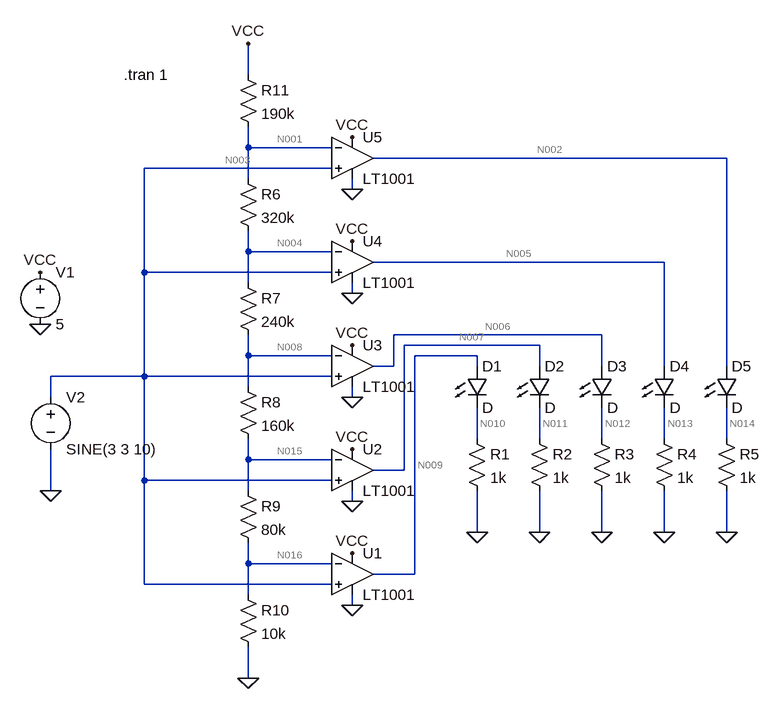
[diagram p0: schematic ComparotorLEDVolumeLadder.asc]
ComparotorLEDVolumeLadder.asc, the LTspice schematic file:
Version 4
SHEET 1 928 680
WIRE 112 -448 112 -496
WIRE 112 -336 112 -368
WIRE 240 -336 112 -336
WIRE 848 -320 304 -320
WIRE 240 -304 -48 -304
WIRE 112 -288 112 -336
WIRE 272 -272 272 -288
WIRE 112 -176 112 -208
WIRE 240 -176 112 -176
WIRE 752 -160 304 -160
WIRE -48 -144 -48 -304
WIRE 240 -144 -48 -144
WIRE 112 -128 112 -176
WIRE 272 -112 272 -128
WIRE 656 -48 336 -48
WIRE 560 -32 352 -32
WIRE 112 -16 112 -48
WIRE 240 -16 112 -16
WIRE 464 -16 368 -16
WIRE 336 0 336 -48
WIRE 336 0 304 0
WIRE 464 0 464 -16
WIRE 560 0 560 -32
WIRE 656 0 656 -48
WIRE 752 0 752 -160
WIRE 848 0 848 -320
WIRE -48 16 -48 -144
WIRE -48 16 -192 16
WIRE 240 16 -48 16
WIRE 112 32 112 -16
WIRE -192 48 -192 16
WIRE 272 48 272 32
WIRE 464 112 464 64
WIRE 560 112 560 64
WIRE 656 112 656 64
WIRE 752 112 752 64
WIRE 848 112 848 64
WIRE 112 144 112 112
WIRE 240 144 112 144
WIRE 352 160 352 -32
WIRE 352 160 304 160
WIRE -48 176 -48 16
WIRE 240 176 -48 176
WIRE -192 192 -192 128
WIRE 112 192 112 144
WIRE 272 208 272 192
WIRE 464 256 464 192
WIRE 560 256 560 192
WIRE 656 256 656 192
WIRE 752 256 752 192
WIRE 848 256 848 192
WIRE 112 304 112 272
WIRE 240 304 112 304
WIRE 368 320 368 -16
WIRE 368 320 304 320
WIRE -48 336 -48 176
WIRE 240 336 -48 336
WIRE 112 352 112 304
WIRE 272 368 272 352
WIRE 112 480 112 432
FLAG 272 368 0
FLAG 272 208 0
FLAG 272 -112 0
FLAG 272 48 0
FLAG 272 -272 0
FLAG 464 256 0
FLAG 560 256 0
FLAG 656 256 0
FLAG 752 256 0
FLAG 848 256 0
FLAG 272 288 VCC
FLAG 272 128 VCC
FLAG 272 -32 VCC
FLAG 272 -352 VCC
FLAG 112 480 0
FLAG -208 -64 0
FLAG -208 -144 VCC
FLAG -192 192 0
FLAG 112 -496 VCC
FLAG 272 -192 VCC
SYMBOL LED 544 0 R0
SYMATTR InstName D2
SYMBOL LED 640 0 R0
SYMATTR InstName D3
SYMBOL LED 736 0 R0
SYMATTR InstName D4
SYMBOL LED 832 0 R0
SYMATTR InstName D5
SYMBOL res 448 96 R0
SYMATTR InstName R1
SYMATTR Value 1k
SYMBOL res 544 96 R0
SYMATTR InstName R2
SYMATTR Value 1k
SYMBOL res 640 96 R0
SYMATTR InstName R3
SYMATTR Value 1k
SYMBOL res 736 96 R0
SYMATTR InstName R4
SYMATTR Value 1k
SYMBOL res 832 96 R0
SYMATTR InstName R5
SYMATTR Value 1k
SYMBOL res 96 -304 R0
SYMATTR InstName R6
SYMATTR Value 320k
SYMBOL res 96 -144 R0
SYMATTR InstName R7
SYMATTR Value 240k
SYMBOL res 96 16 R0
SYMATTR InstName R8
SYMATTR Value 160k
SYMBOL res 96 176 R0
SYMATTR InstName R9
SYMATTR Value 80k
SYMBOL res 96 336 R0
SYMATTR InstName R10
SYMATTR Value 10k
SYMBOL voltage -208 -160 R0
WINDOW 123 0 0 Left 0
WINDOW 39 0 0 Left 0
SYMATTR InstName V1
SYMATTR Value 5
SYMBOL voltage -192 32 R0
WINDOW 123 0 0 Left 0
WINDOW 39 0 0 Left 0
SYMATTR InstName V2
SYMATTR Value SINE(3 3 10)
SYMBOL res 96 -464 R0
SYMATTR InstName R11
SYMATTR Value 190k
SYMBOL OpAmps\\LT1001 272 -384 R0
SYMATTR InstName U5
SYMBOL OpAmps\\LT1001 272 256 R0
SYMATTR InstName U1
SYMBOL OpAmps\\LT1001 272 96 R0
SYMATTR InstName U2
SYMBOL OpAmps\\LT1001 272 -64 R0
SYMATTR InstName U3
SYMBOL OpAmps\\LT1001 272 -224 R0
SYMATTR InstName U4
SYMBOL LED 448 0 R0
SYMATTR InstName D1
TEXT -80 -448 Left 2 !.tran 1

The netlist it stands for:
* ComparotorLEDVolumeLadder.asc
D2 N007 N011 D
D3 N006 N012 D
D4 N005 N013 D
D5 N002 N014 D
R1 N010 0 1k
R2 N011 0 1k
R3 N012 0 1k
R4 N013 0 1k
R5 N014 0 1k
R6 N001 N004 320k
R7 N004 N008 240k
R8 N008 N015 160k
R9 N015 N016 80k
R10 N016 0 10k
V1 VCC 0 5
V2 N003 0 SINE(3 3 10)
R11 VCC N001 190k
XU5 N003 N001 VCC 0 N002 LT1001  ; pins In+ In- V+ V- OUT
XU1 N003 N016 VCC 0 N009 LT1001  ; pins In+ In- V+ V- OUT
XU2 N003 N015 VCC 0 N007 LT1001  ; pins In+ In- V+ V- OUT
XU3 N003 N008 VCC 0 N006 LT1001  ; pins In+ In- V+ V- OUT
XU4 N003 N004 VCC 0 N005 LT1001  ; pins In+ In- V+ V- OUT
D1 N009 N010 D
.model D D
.lib standard.dio
.tran 1
.lib LTC.lib
.backanno
.end

* Results of the author's LTspice run, read from the files saved beside the schematic
* Operating Point, zero values left out:
*   V(n007) = 3.954 V
*   V(n011) = 3.268 V
*   V(n006) = 3.954 V
*   V(n012) = 3.268 V
*   V(n005) = 919.2 mV
*   V(n013) = 295.6 mV
*   V(n002) = 919.1 mV
*   V(n014) = 295.5 mV
*   V(n010) = 3.268 V
*   V(n001) = 4.066 V
*   V(n004) = 3.111 V
*   V(n008) = 2.396 V
*   V(n015) = 1.917 V
*   V(n016) = 1.437 V
*   V(vcc) = 5 V
*   V(n003) = 3 V
*   V(n009) = 3.954 V
*   I(D1) = 3.268 mA
*   I(D5) = 295.5 µA
*   I(D4) = 295.6 µA
*   I(D3) = 3.268 mA
*   I(D2) = 3.268 mA
*   I(R11) = 4.914 µA
*   I(R10) = 143.7 µA
*   I(R9) = 5.998 µA
*   I(R8) = 2.991 µA
*   I(R7) = 2.983 µA
*   I(R6) = 2.984 µA
*   I(R5) = 295.5 µA
*   I(R4) = 295.6 µA
*   I(R3) = 3.268 mA
*   I(R2) = 3.268 mA
*   I(R1) = 3.268 mA
*   I(V2) = -138.8 µA
*   I(V1) = -17.34 mA
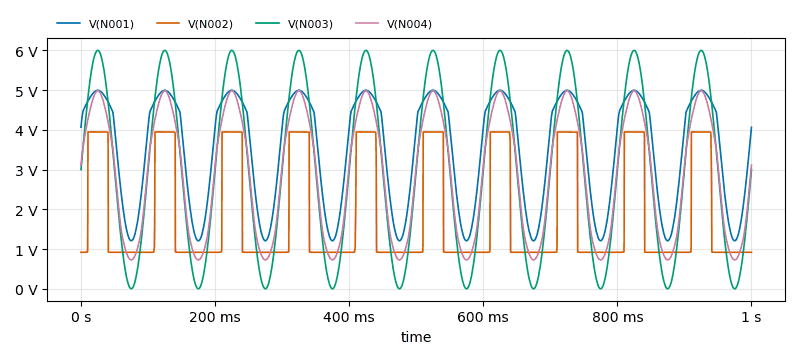
[diagram p1: Transient Analysis of ComparotorLEDVolumeLadder.asc, plotted from the saved traces]
* Transient Analysis, 1 run:
*   V(N001): min 1.209 V, max 4.996 V, average 3.496 V, rms 3.766 V, last 4.066 V
*   V(N002): min 918.6 mV, max 3.949 V, average 1.84 V, rms 2.304 V, last 919.1 mV
*   V(N003): min 53.69 µV, max 6 V, average 3 V, rms 3.675 V, last 3 V
*   V(N004): min 728.8 mV, max 4.986 V, average 2.907 V, rms 3.297 V, last 3.111 V